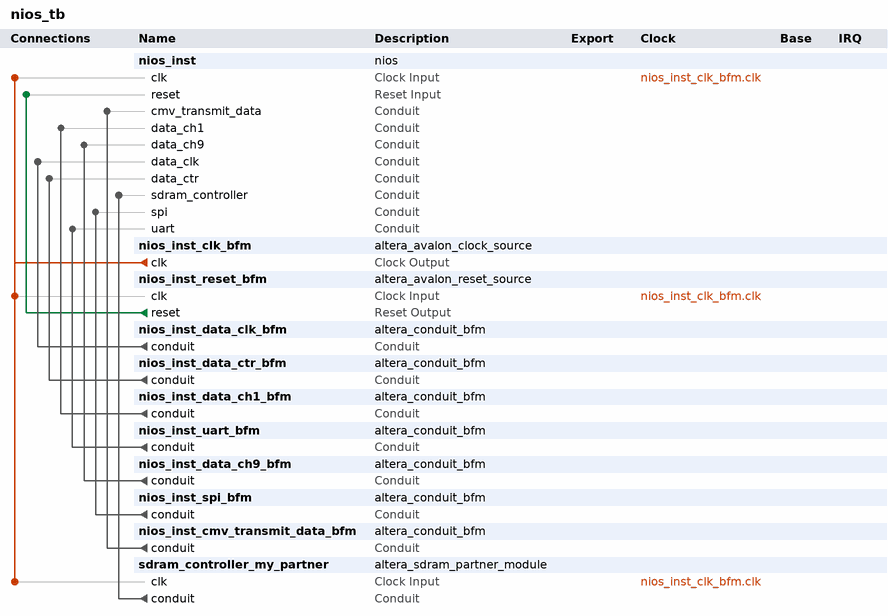
[diagram p0: system contents]
# Platform Designer (Qsys) system nios_tb, Cyclone III EP3C16F484C6
# Parameters at their usual value, and those the tool derives, are not listed.
package require -exact qsys 13.0
create_system nios_tb
set_project_property DEVICE_FAMILY {Cyclone III}
set_project_property DEVICE EP3C16F484C6

add_instance nios_inst nios 1.0

add_instance nios_inst_clk_bfm altera_avalon_clock_source 13.0

add_instance nios_inst_reset_bfm altera_avalon_reset_source 13.0
set_instance_parameter_value nios_inst_reset_bfm ASSERT_HIGH_RESET 0
set_instance_parameter_value nios_inst_reset_bfm INITIAL_RESET_CYCLES 50

add_instance nios_inst_data_clk_bfm altera_conduit_bfm 13.0
set_instance_parameter_value nios_inst_data_clk_bfm CLOCKED_SIGNAL false
set_instance_parameter_value nios_inst_data_clk_bfm ENABLE_RESET false
set_instance_parameter_value nios_inst_data_clk_bfm SIGNAL_WIDTHS 1
set_instance_parameter_value nios_inst_data_clk_bfm SIGNAL_DIRECTIONS output

add_instance nios_inst_data_ctr_bfm altera_conduit_bfm 13.0
set_instance_parameter_value nios_inst_data_ctr_bfm CLOCKED_SIGNAL false
set_instance_parameter_value nios_inst_data_ctr_bfm ENABLE_RESET false
set_instance_parameter_value nios_inst_data_ctr_bfm SIGNAL_WIDTHS 10
set_instance_parameter_value nios_inst_data_ctr_bfm SIGNAL_DIRECTIONS output

add_instance nios_inst_data_ch1_bfm altera_conduit_bfm 13.0
set_instance_parameter_value nios_inst_data_ch1_bfm CLOCKED_SIGNAL false
set_instance_parameter_value nios_inst_data_ch1_bfm ENABLE_RESET false
set_instance_parameter_value nios_inst_data_ch1_bfm SIGNAL_WIDTHS 10
set_instance_parameter_value nios_inst_data_ch1_bfm SIGNAL_DIRECTIONS output

add_instance nios_inst_uart_bfm altera_conduit_bfm 13.0
set_instance_parameter_value nios_inst_uart_bfm CLOCKED_SIGNAL false
set_instance_parameter_value nios_inst_uart_bfm ENABLE_RESET false
set_instance_parameter_value nios_inst_uart_bfm SIGNAL_ROLES rxd,txd
set_instance_parameter_value nios_inst_uart_bfm SIGNAL_WIDTHS 1,1
set_instance_parameter_value nios_inst_uart_bfm SIGNAL_DIRECTIONS output,input

add_instance nios_inst_data_ch9_bfm altera_conduit_bfm 13.0
set_instance_parameter_value nios_inst_data_ch9_bfm CLOCKED_SIGNAL false
set_instance_parameter_value nios_inst_data_ch9_bfm ENABLE_RESET false
set_instance_parameter_value nios_inst_data_ch9_bfm SIGNAL_WIDTHS 10
set_instance_parameter_value nios_inst_data_ch9_bfm SIGNAL_DIRECTIONS output

add_instance nios_inst_spi_bfm altera_conduit_bfm 13.0
set_instance_parameter_value nios_inst_spi_bfm CLOCKED_SIGNAL false
set_instance_parameter_value nios_inst_spi_bfm ENABLE_RESET false
set_instance_parameter_value nios_inst_spi_bfm SIGNAL_ROLES MISO,MOSI,SCLK,SS_n
set_instance_parameter_value nios_inst_spi_bfm SIGNAL_WIDTHS 1,1,1,1
set_instance_parameter_value nios_inst_spi_bfm SIGNAL_DIRECTIONS output,input,input,input

add_instance nios_inst_cmv_transmit_data_bfm altera_conduit_bfm 13.0
set_instance_parameter_value nios_inst_cmv_transmit_data_bfm CLOCKED_SIGNAL false
set_instance_parameter_value nios_inst_cmv_transmit_data_bfm ENABLE_RESET false
set_instance_parameter_value nios_inst_cmv_transmit_data_bfm SIGNAL_WIDTHS 8
set_instance_parameter_value nios_inst_cmv_transmit_data_bfm SIGNAL_DIRECTIONS input

add_instance sdram_controller_my_partner altera_sdram_partner_module 11.0
set_instance_parameter_value sdram_controller_my_partner SDRAM_DATA_WIDTH 16
set_instance_parameter_value sdram_controller_my_partner SDRAM_COL_WIDTH 8
set_instance_parameter_value sdram_controller_my_partner SDRAM_ROW_WIDTH 12
set_instance_parameter_value sdram_controller_my_partner CONTR_NAME nios_sdram_controller

# connections
add_connection nios_inst_clk_bfm.clk nios_inst.clk clock
add_connection nios_inst_clk_bfm.clk nios_inst_reset_bfm.clk clock
add_connection nios_inst_clk_bfm.clk sdram_controller_my_partner.clk clock
add_connection nios_inst_reset_bfm.reset nios_inst.reset reset
add_connection nios_inst_cmv_transmit_data_bfm.conduit nios_inst.cmv_transmit_data conduit
add_connection nios_inst_data_ch1_bfm.conduit nios_inst.data_ch1 conduit
add_connection nios_inst_data_ch9_bfm.conduit nios_inst.data_ch9 conduit
add_connection nios_inst_data_clk_bfm.conduit nios_inst.data_clk conduit
add_connection nios_inst_data_ctr_bfm.conduit nios_inst.data_ctr conduit
add_connection nios_inst_spi_bfm.conduit nios_inst.spi conduit
add_connection nios_inst_uart_bfm.conduit nios_inst.uart conduit
add_connection sdram_controller_my_partner.conduit nios_inst.sdram_controller conduit

set_interconnect_requirement {$system} qsys_mm.clockCrossingAdapter HANDSHAKE
set_interconnect_requirement {$system} qsys_mm.maxAdditionalLatency 1

save_system nios_tb.qsys
